# Altium schematic sheet PAGE1.SchDoc
size 246 x 182 mm
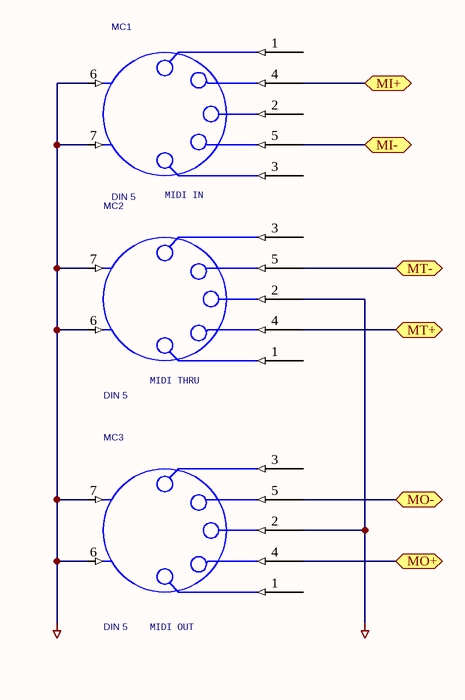
[diagram p0: PAGE1.SchDoc]

## Parts
MC1  DIN 5  [DIN 5 PIN A]
MC2  DIN 5  [DIN 5 PIN A]
MC3  DIN 5  [DIN 5 PIN A]

## Ports
MI+, MI-, MO+, MO-, MT+, MT-

## Nets
AGND: MC1.6 MC1.7 MC2.2 MC2.6 MC2.7 MC3.2 MC3.6 MC3.7
MI+: MC1.4 ; port MI+
MI-: MC1.5 ; port MI-
MO+: MC3.4 ; port MO+
MO-: MC3.5 ; port MO-
MT+: MC2.4 ; port MT+
MT-: MC2.5 ; port MT-

Not connected (* = marked no-connect by the designer): MC1 1 2 3; MC2 1 3; MC3 1 3

## Notes on the sheet
- (near MC1) MIDI IN
- (near MC2) MIDI THRU
- (near MC3) MIDI OUT

## Library data of the parts
MC1-MC3 = DIN 5_0: PART NO: 161-0505